# Altium schematic sheet 0-WeightSensor.SchDoc
size A4; Author: Fabian Castaño; CompanyName: UdeA; Engineer: Fabian Castaño; Organization: Universidad de Antioquia; Address1: UdeA; Address2: Medellín; Address3: Antioquia; Address4: Colombia 050010
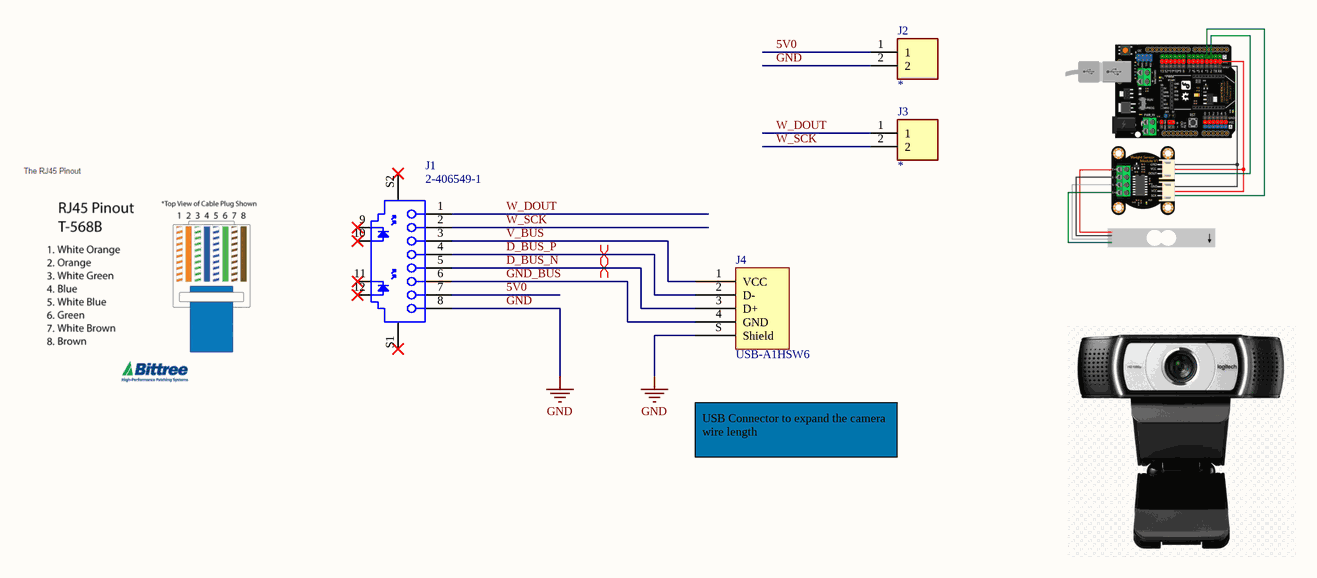
[diagram p0: 0-WeightSensor.SchDoc]

## Parts
J1  2-406549-1  [TECO-2-406549-1_V]
J2  282841-2  [TE_282841-2]  (value not drawn)
J3  282841-2  [TE_282841-2]  (value not drawn)
J4  USB-A1HSW6  [ON SHORE TECHNOLOGY USB-A1HSW6]

## Nets
GND: J1.8 J2.2 J4.S(Shield)
5V0: J1.7 J2.1
D_BUS_N: J1.5 J4.3(D+)
D_BUS_P: J1.4 J4.2(D-)
GND_BUS: J1.6 J4.4(GND)
V_BUS: J1.3 J4.1(VCC)
W_DOUT: J1.1 J3.1
W_SCK: J1.2 J3.2

Not connected (* = marked no-connect by the designer): J1 9* 10* 11* 12* S1* S2*

## Layout directives
differential pair: D_BUS_N, D_BUS_P

## Notes on the sheet
- USB Connector to expand the camera wire length
- Title
- Size:
- Date:
- A4
- Enginner:
- Time:
- Revision:
- Sheet
- of
- Author:
- File:

## Library data of the parts
J1 = CMP-2000-05541-1: RJ45 Connector, Pitch 1.016 mm, 8 Position, Height 14.22 mm, Tail Length 3.18 mm, RoHS, Tray; Manufacturer: TE Connectivity; Number of Ports: 1; Tab Direction: Up; Ratings: Cat5; Catalog Drawings: JackSideEntryInverted / JackSideEntryInvertedSide; Number of Positions/Contacts: 8p8c(RJ45,Ethernet); 3D Model: 2-406549-1.pdf; Other Names: 2-406549-1-ND / A97715; Shielding: Shielded,EMIFinger; LED Color: Yellow-Green; Dynamic Catalog: ModularJacks; Connector Type: Jack; Termination: Solder; Mounting Type: ThroughHole; Datasheet URL: http://www.te.com/commerce/DocumentDelivery/DDEController?Action=showdoc&DocId=Customer+Drawing%7F406549%7FT%7Fpdf%7FEnglish%7FENG_CD_406549_T.pdf%7F2-406549-1; Mounting Technology: ThroughHole; Package Reference: 2-406549-1; RoHS Information: 2-406549-1StatementofCompliance; Housing Material: Thermoplastic; Standard Package: 63; Number of Rows: 1; Category: Connectors,Interconnects; Contact Material: PhosphorBronze; Contact Finish Thickness: 50µin(1.27µm); Family: ModularConnectors-Jacks; Packaging: Tray; Datasheet Version: Rev. T, 11/2014; Operating Temperature: -40°C~85°C; Orientation: 90°Angle(Right); Contact Finish: Gold; Features: BoardGuide; Package Description: RJ45 Connector, Pitch 1.016 mm, 8 Position, Height 14.22 mm, Tail Length 3.18 mm; Manufacturer URL: http://www.te.com/
J2 J3 = 282841-2: Conn Terminal Block 2 POS 5.08mm Solder ST Thru-Hole 17.5A/Contact; MF: TE Connectivity; SnapEDA_Link: https://www.snapeda.com/parts/282841-2/TE%20Connectivity%20AMP%20Connectors/view-part/434231/?ref=snap; Availability: Unavailable; TE_purchase_URL: https://www.te.com/usa-en/product-282841-2.html?te_bu=Cor&te_type=disp&te_campaign=seda_glo_cor-seda-global-disp-prtnr-fy19-seda-model-bom-cta_sma-317_1&elqCampaignId=32493; Value: *; EU_RoHS_Compliance: Compliant with Exemptions; Price: None; MP: 282841-2; Package: None; Comment_1: *
J4 = USB-A1HSW6: CONN RCPT TYPEA 4POS R/A; Part Number: USB-A1HSW6